# Altium schematic sheet IR LED.SchDoc
size A4; SheetNumber: 1; SheetTotal: 1
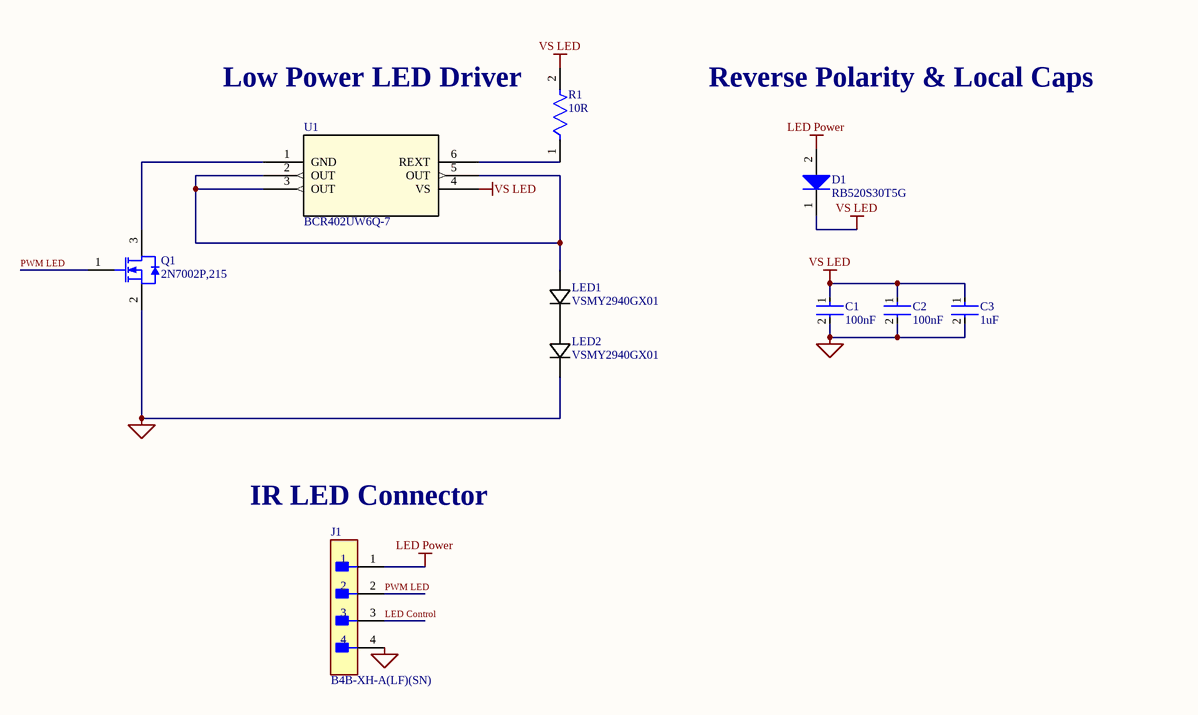
[diagram p0: IR LED.SchDoc]

## Parts
C1  100nF  [FP-CL10-IPC_A]
C2  100nF  [FP-CL10-IPC_A]
C3  1uF  [FP-GCM21B-0_15-MFG]
D1  RB520S30T5G  [ONSC-SOD-523-2-502-01_V]
J1  B4B-XH-A(LF)(SN)  [FP-B4B-XH-A_LF_SN-MFG]
LED1  VSMY2940GX01  [DIODE_VSMY2940GX01_VIS]
LED2  VSMY2940GX01  [DIODE_VSMY2940GX01_VIS]
Q1  2N7002P,215  [NXP-SOT23_L]
R1  10R  [FP-RMCF0805-IPC_B]
U1  BCR402UW6Q-7  [BCR402UW6Q-7_DIO]

## Nets
GND: C1.2 C2.2 C3.2 J1.4 LED2.1 Q1.2(S)
LED Power: D1.2(A) J1.1
VS LED: C1.1 C2.1 C3.1 D1.1(K) R1.2 U1.4(VS)
LED Control: J1.3
PWM LED: J1.2 Q1.1(G)
NetLED1_1: LED1.1 LED2.2
NetLED1_2: LED1.2 U1.2(OUT) U1.3(OUT) U1.5(OUT)
NetQ1_3: Q1.3(D) U1.1(GND)
NetR1_1: R1.1 U1.6(REXT)

## Notes on the sheet
- Low Power LED Driver
- Reverse Polarity & Local Caps
- IR LED Connector

## Library data of the parts
C1 C2 = CMP-13271-003556-1: Cap Ceramic 100nF 25V X7R ±10% Pad SMD 0603 +125°C T/R CL10B104KA8WPNC; Case Code (Metric): 1608; Thickness: 0.035inch; Voltage Rating: 25V; Features: Soft Termination; Max Operating Temperature: 125°C; Length: 0.063inch; Mount: Surface Mount; Capacitance: 100nF; Packaging: Tape and Reel; Min Operating Temperature: -55°C; Tolerance: 10%; Case/Package: 0603; Case Code (Imperial): 0603; Ratings: AEC-Q200; Width: 0.031inch
C3 = CMP-06035-008660-1: Ceramic Capacitor for Automotive 1uF ±20% 50VDC X7R 0805 Embossed T/R GCM21BR71H105MA03L
D1 = CMP-1055-00481-1: Schottky Barrier Diode, 2-Pin SOD-523, Pb-Free, Tape and Reel; Manufacturer: On Semiconductor; Configuration: Single; Mounting Technology: Surface Mount; ComponentLink1URL: http://www.onsemi.com/; ComponentLink3Description: Package Specification; Packing: Tape and Reel; ComponentLink2Description: Datasheet; PackageVersion: Rev. E, 09/2010; PackageReference: SOD-523-2-502-01; ComponentLink2URL: http://www.onsemi.cn/pub_link/Collateral/RB520S30T1-D.PDF; ComponentLink1Description: Manufacturer URL; DatasheetVersion: Rev. 10; RoHS: TRUE; ComponentLink3URL: http://www.onsemi.com/pub_link/Collateral/502-01.PDF; PackageDescription: 2-Pin SOD, Body 1.2 x 0.8 mm; PartNumber: RB520S30T5G
J1 = CMP-17439-000250-1: CONN HEADER VERT 4POS 2.5MM; Number of Contacts: 4; Contact Resistance: 20mR; Voltage Rating: 250V; Max Current Rating: 3A; Gender: Male; Wire/Cable Gauge: 22AWG; Mated Stacking Heights: 9.8mm; Insulation Resistance: 1GR; Orientation: Straight; Contact Type: Male Pin; Contact Finish - Mating: TIN; Series: XH; Max Voltage Rating (AC): 250V; Lead Pitch: 2.5mm; Contact Shape: Square; Insulation Color: Natural; Termination: Solder; Lead Free: Lead Free; Voltage Rating (AC): 250V; Number of Rows: 1; Flammability Rating: UL94 V-0; Number of Positions: 4; Max Operating Temperature: 85°C; Package Quantity: 500; Mount: Through Hole; REACH SVHC: No SVHC; Connector Type: Header; Insulation Material: Nylon; Fastening Type: Detent; Min Operating Temperature: -25°C; Housing Color: White; Packaging: Bulk; Contact Plating: Tin; Contact Material: Brass; Max Voltage Rating (DC): 250V; Housing Material: Polyamide; Color: Natural; Material: Polyamide; Pitch: 2.5mm; Depth: 5.75mm; Current Rating: 3A; Length: 12.4mm
LED1 LED2 = VSMY2940GX01: No Description Available; Mfr_Name: Vishay
Q1 = CMP-1259-00082-1: N-Channel Trench MOSFET, 60 V, 0.36 A, -55 to 150 degC, 3-Pin SOT23, Tape and Reel; Manufacturer: NXP Semiconductors; Channel Type: N; Automotive Qualified: Y; VDS [max] (V): 60; Packing: Tape & Reel; ID [max] (A): 0.36; VGSth [typ] (V): 1.75; IDM [max] (A): 1.2; ComponentLink2URL: http://www.nxp.com/documents/data_sheet/2N7002P.pdf; PackageReference: SOT23; PackageVersion: 06-03-16, 03/2006; ComponentLink1URL: http://www.nxp.com/; ComponentLink2Description: Datasheet; Mounting Technology: Surface Mount; PackageDescription: 3-Pin Small Outline Transistor Package, Body 2.9 x 1.3 mm, Pitch 0.95 mm; Code_JEDEC: TO-236AB; ComponentLink1Description: Manufacturer URL; PartNumber: 2N7002P,215; ComponentLink3Description: Package Specification; DatasheetVersion: Rev. 02; ComponentLink3URL: http://www.nxp.com/documents/outline_drawing/sot023_po.pdf
R1 = CMP-26527-004108-1: 10Ω ±1% 0.125W 0805 Thick Film Chip Resistor AEC-Q200 compliant RMCF0805FG10R0; Max Power Dissipation: 125mW; Temperature Coefficient: 100ppm/°C; Series: RMCF; Resistor Type: Thick Film; Width: 0.049inch; Contact Plating: Tin; Resistance: 10R; Number of Terminations: 2; Radiation Hardening: No; Max Operating Temperature: 155°C; Length: 0.079inch; RoHS Compliant: Yes; Mount: Surface Mount; Tolerance: 1%; Case/Package: 0805; Packaging: Tape and Reel; Min Operating Temperature: -55°C; Height: 0.026inch; Features: Automotive AEC-Q200
U1 = BCR402UW6Q-7: No Description Available; Manufacturer_Name: Diodes Inc; Copyright: Copyright (C) 2026 Ultra Librarian. All rights reserved.; Manufacturer_Part_Number: BCR402UW6Q-7; RefDes: RefDes; Type: Type